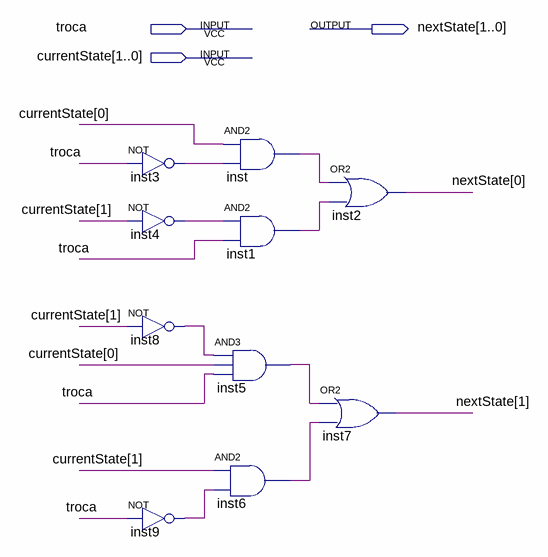
[diagram p0: schematic sheet]
// Quartus schematic NextStateLogic.bdf as structural Verilog: 10 symbols, 3 pins
module NextStateLogic (
  input  troca,
  input  [1:0] currentState,
  output [1:0] nextState
);

  wire inst1_out, inst3_out, inst4_out, inst5_out, inst6_out, inst8_out, inst9_out, inst_out;

  not inst3 (inst3_out, troca);
  not inst4 (inst4_out, currentState[1]);
  not inst8 (inst8_out, currentState[1]);
  not inst9 (inst9_out, troca);
  and inst (inst_out, currentState[0], inst3_out);
  and inst1 (inst1_out, inst4_out, troca);
  and inst5 (inst5_out, inst8_out, currentState[0], troca);
  and inst6 (inst6_out, currentState[1], inst9_out);
  or inst2 (nextState[0], inst_out, inst1_out);
  or inst7 (nextState[1], inst5_out, inst6_out);
endmodule
